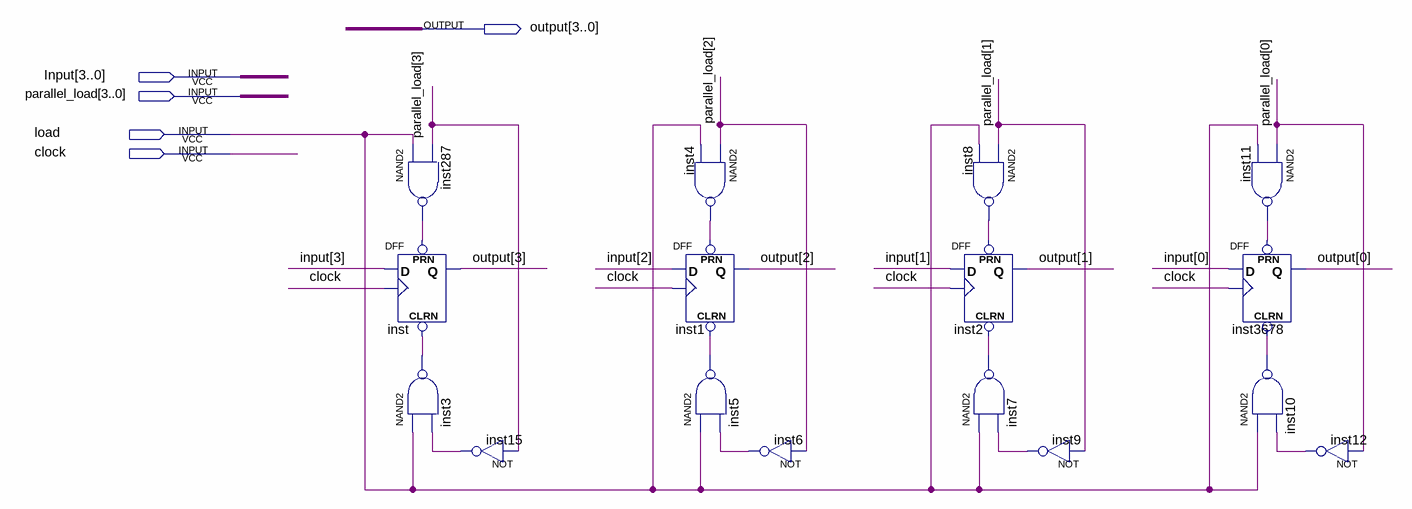
[diagram p0: schematic sheet]
// Quartus schematic registradores.bdf as structural Verilog: 16 symbols, 5 pins
module registradores (
  input  [3:0] Input,
  input  [3:0] parallel_load,
  input  load,
  input  clock,
  output [3:0] \output 
);

  wire inst3_out, inst4_out, inst5_out, inst6_out, inst7_out, inst8_out, inst9_out, inst10_out, inst11_out,
       inst12_out, inst15_out, inst287_out;

  nand inst287 (inst287_out, load, parallel_load[3]);
  DFF inst (.CLRN(inst3_out), .CLK(clock), .D(Input[3]), .PRN(inst287_out), .Q(\output [3]));
  nand inst3 (inst3_out, load, inst15_out);
  not inst15 (inst15_out, parallel_load[3]);
  nand inst4 (inst4_out, parallel_load[2], load);
  DFF inst1 (.CLRN(inst5_out), .CLK(clock), .D(Input[2]), .PRN(inst4_out), .Q(\output [2]));
  nand inst5 (inst5_out, load, inst6_out);
  not inst6 (inst6_out, parallel_load[2]);
  DFF inst2 (.CLRN(inst7_out), .CLK(clock), .D(Input[1]), .PRN(inst8_out), .Q(\output [1]));
  nand inst8 (inst8_out, parallel_load[1], load);
  nand inst7 (inst7_out, load, inst9_out);
  not inst9 (inst9_out, parallel_load[1]);
  nand inst11 (inst11_out, parallel_load[0], load);
  DFF inst3678 (.CLRN(inst10_out), .CLK(clock), .D(Input[0]), .PRN(inst11_out), .Q(\output [0]));
  nand inst10 (inst10_out, load, inst12_out);
  not inst12 (inst12_out, parallel_load[0]);
endmodule
